# Altium project Stove_Light.PrjPcb
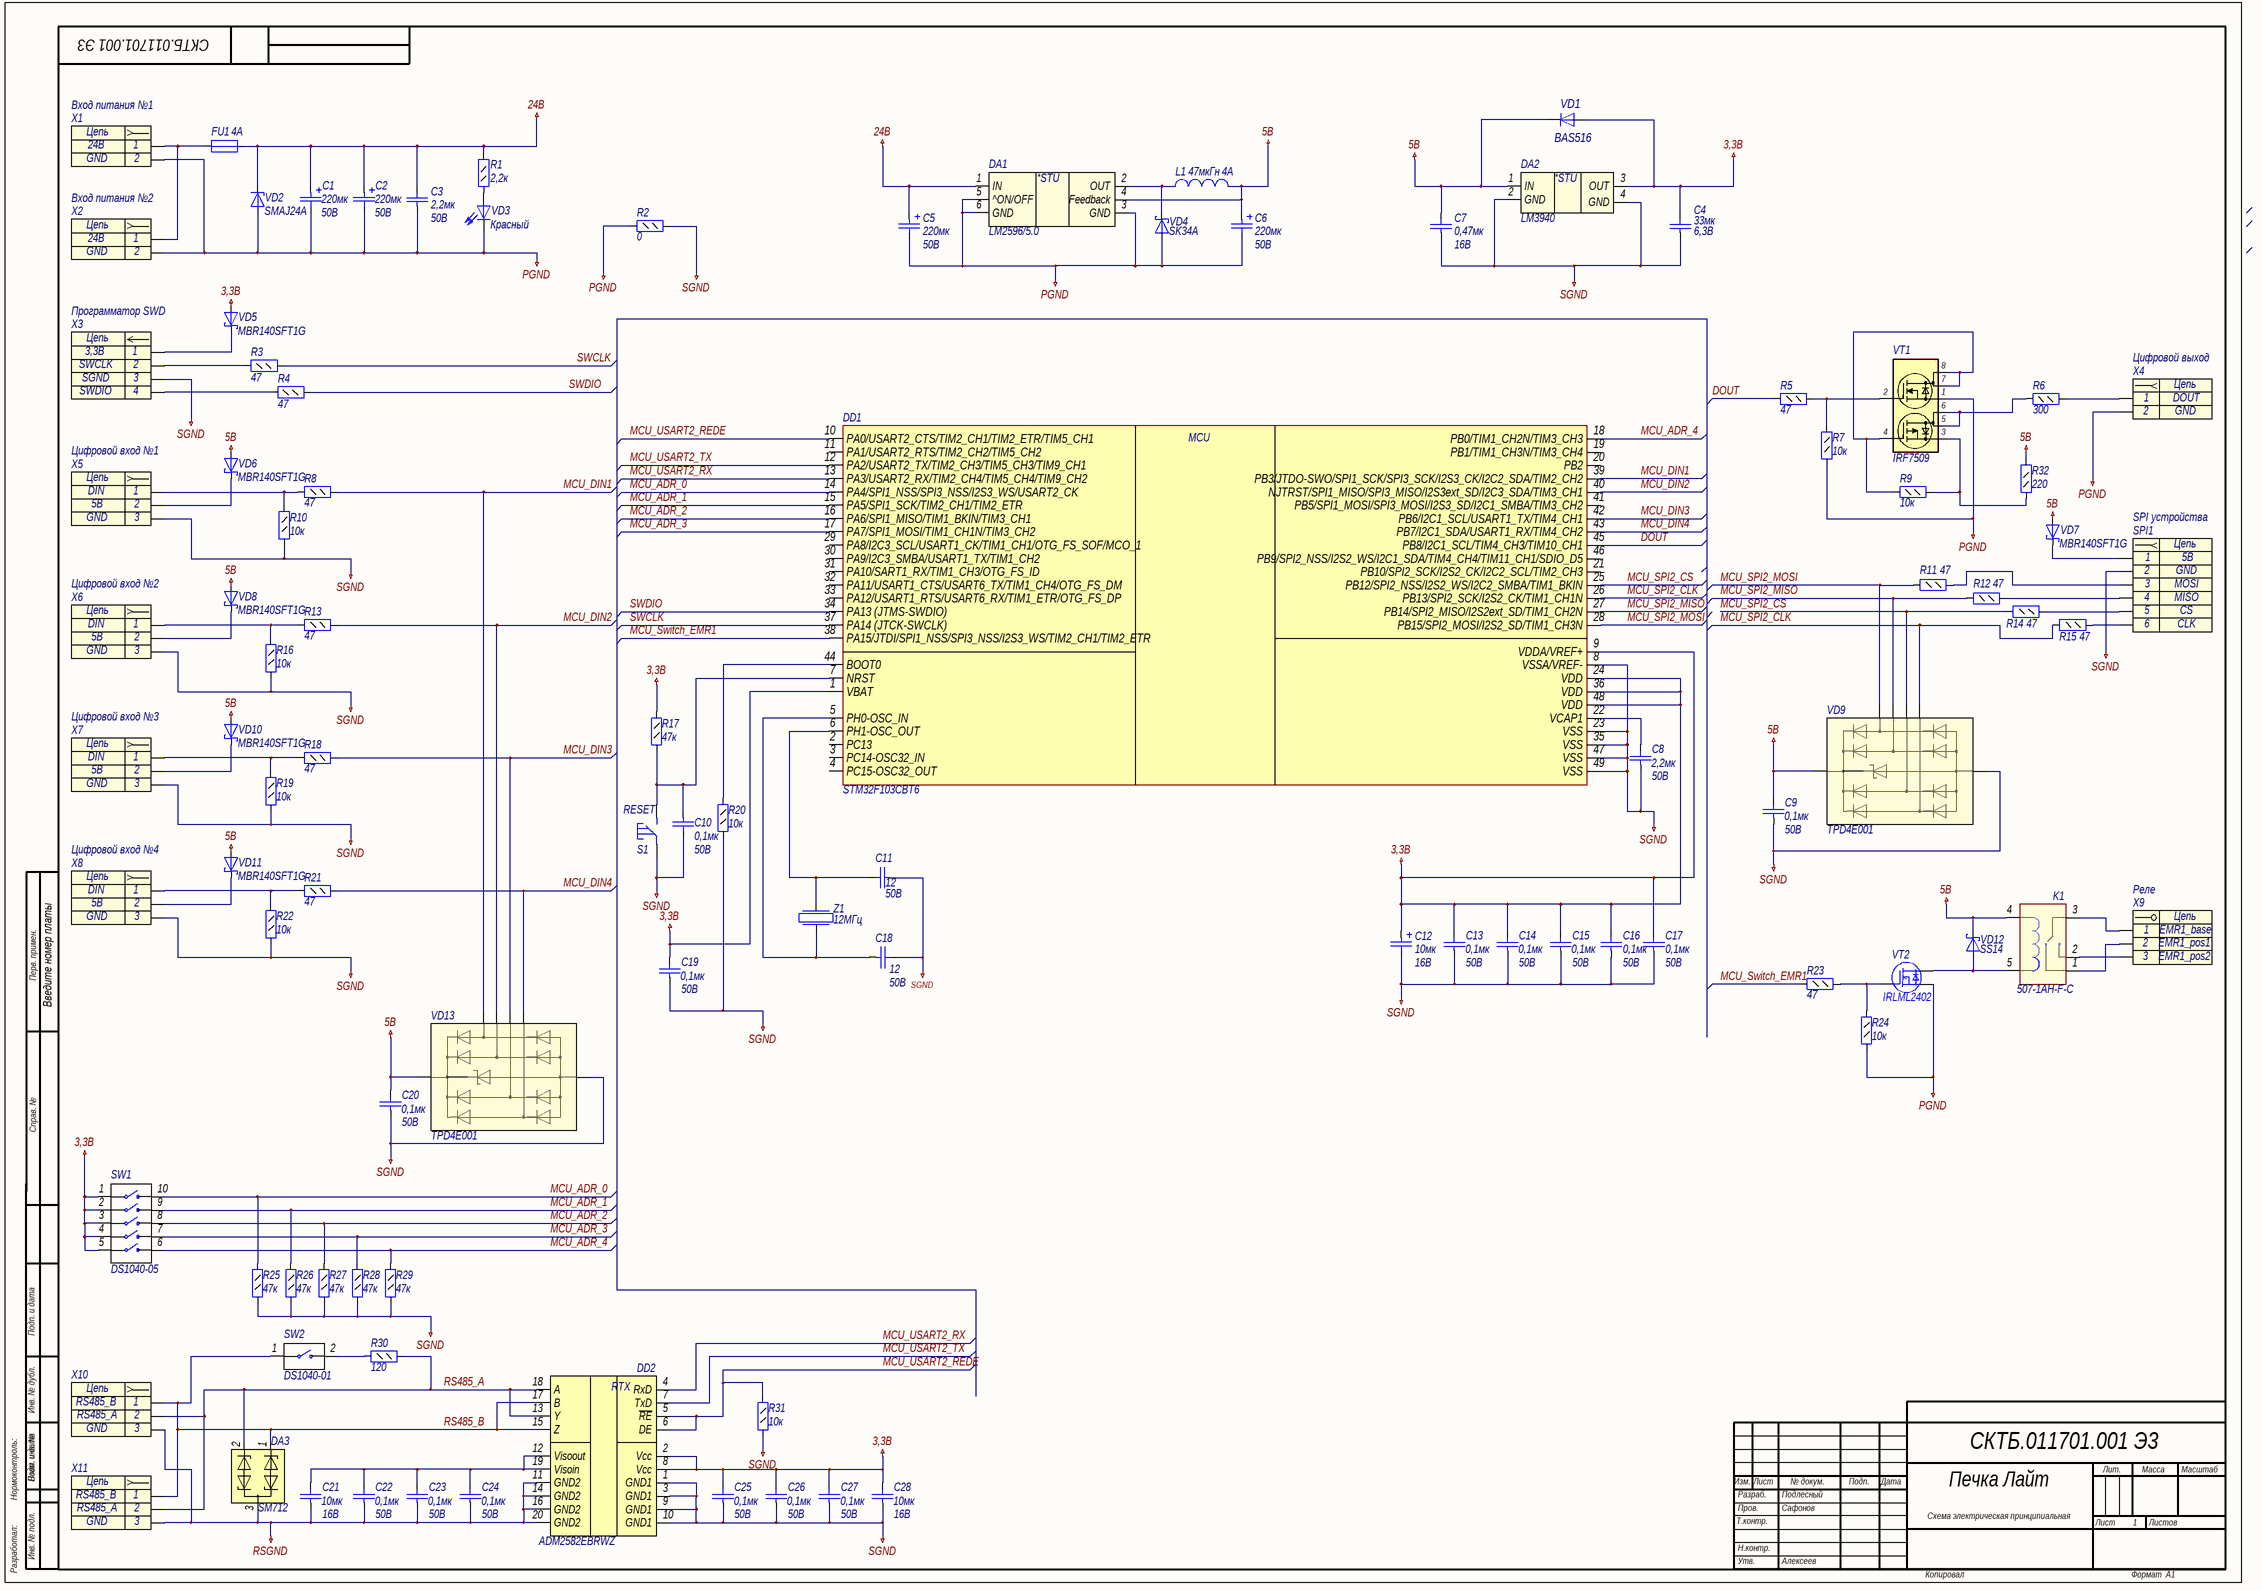
[diagram p0: Stove_Light.SchDoc]
1 sheet, 99 parts. Net scope: global (net labels, ports and power ports of the same name join across sheets).
Board file: Stove_Light.PcbDoc

## Sheet Stove_Light.SchDoc: Печка Лайт
size 840 x 594 mm; ApprovedBy: Алексеев; CheckedBy: Сафонов; Author: Подлесный; CompanyName: ЦНИИ РТК; DrawnBy: Подлесный; Engineer: Подлесный; Organization: ЦНИИ РТК; DocumentNumber: СКТБ.011701.001 Э3; Revision: Королев; SheetTotal: 1; DocumentType: Схема электрическая принципиальная; Format: A1; PageSetup: Record=PageOptions|CenterHorizontal=True|CenterVertical=True|PrintScale=0.33|XCorrection=1.00|YCorrection=1.00|PrintKind=1|BorderSize=5000000|LeftOffset=0|BottomOffset=0|Orientation=2|PaperLength=2970|PaperWidth=2100|Scale=100|PaperSource=7|PrintQuality=600|MediaType=1|DitherType=10|PrintScaleMode=1|PaperKind=A4|PaperIndex=9; DocumentName: Печка Лайт; ImagePath: Введите номер платы

### Parts
C1  220мк  Voltage: 50В  [Cap_SMD_radial_polar(10x10.5)]
C2  220мк  Voltage: 50В  [Cap_SMD_radial_polar(10x10.5)]
C3  Voltage: 50В  [C1206]  (hidden comment: 2,2мк)
C4  value 33мк  Voltage: 6,3В  [C1210]  (hidden comment: 1мк)
C5  Voltage: 50В  [Cap_SMD_radial_polar(10x10.5)]  (hidden comment: 220мк)
C6  Voltage: 50В  [Cap_SMD_radial_polar(10x10.5)]  (hidden comment: 220мк)
C7  Voltage: 16В  [C0603]  (hidden comment: 0,47мк)
C8  2,2мк  Voltage: 50В  [C1206]
C9  0,1мк  Voltage: 50В  [C0603]
C10  0,1мк  Voltage: 50B  [C0603]
C11  12  Voltage: 50B  [C0603]
C12  10мк  Voltage: 16В  [C1206]
C13  0,1мк  Voltage: 50В  [C0603]
C14  0,1мк  Voltage: 50В  [C0603]
C15  0,1мк  Voltage: 50В  [C0603]
C16  0,1мк  Voltage: 50В  [C0603]
C17  0,1мк  Voltage: 50В  [C0603]
C18  Voltage: 50В  [C0603]  (hidden comment: 12)
C19  0,1мк  Voltage: 50В  [C0603]
C20  0,1мк  Voltage: 50В  [C0603]
C21  10мк  Voltage: 16В  [C0603]
C22  0,1мк  Voltage: 50В  [C0603]
C23  0,1мк  Voltage: 50В  [C0603]
C24  0,1мк  Voltage: 50В  [C0603]
C25  0,1мк  Voltage: 50В  [C0603]
C26  0,1мк  Voltage: 50В  [C0603]
C27  0,1мк  Voltage: 50В  [C0603]
C28  10мк  Voltage: 16В  [C0603]
DA1  LM2596/5.0  [TO-263]
DA2  LM3940  [SOT223]
DA3  SM712  [SOT23-3]
DD1  STM32F103CBT6  [LQFP48_N]
DD2  ADM2582EBRWZ  [SO20W]
FU1  value 4A  [F5.1]  (hidden comment: RXEF300)
K1  507-1AH-F-C  [EMR 845(H)-1C]
L1  Imax: 4А  [SDR0604]  (hidden comment: 47мкГн)
R1  2,2к  [R0603]
R2  0  [R0603]
R3  47  [R0603]
R4  47  [R0603]
R5  47  [R0603]
R6  300  [R0603]
R7  10к  [R0603]
R8  47  [R0603]
R9  10к  [R0603]
R10  10к  [R0603]
R11  47  [R0603]
R12  47  [R0603]
R13  47  [R0603]
R14  47  [R0603]
R15  47  [R0603]
R16  10к  [R0603]
R17  47к  [R0603]
R18  47  [R0603]
R19  10к  [R0603]
R20  10к  [R0603]
R21  47  [R0603]
R22  10к  [R0603]
R23  47  [R0603]
R24  10к  [R0603]
R25  47к  [R0603]
R26  47к  [R0603]
R27  47к  [R0603]
R28  47к  [R0603]
R29  47к  [R0603]
R30  120  [R0603]
R31  10к  [R0603]
R32  220  [R0603]
S1  RESET  [Button_SMD]
SPI1  SPI устройства  [CWF-6]
SW1  DS1040-05  [DIP5_R]
SW2  DS1040-01  [DIP1_R]
VD1  BAS516  [SOD523]
VD2  SMAJ24A  [SMA]
VD3  Красный  [L_0805]
VD4  SK34A  [SMA]
VD5  MBR140SFT1G  [SMA]
VD6  MBR140SFT1G  [SMA]
VD7  MBR140SFT1G  [SMA]
VD8  MBR140SFT1G  [SMA]
VD9  TPD4E001  [SOT23-6]
VD10  MBR140SFT1G  [SMA]
VD11  MBR140SFT1G  [SMA]
VD12  SS14  [SMA]
VD13  TPD4E001  [SOT23-6]
VT1  IRF7509  [Micro8]
VT2  IRLML2402  [SOT23-3_H]
X1  Вход питания №1  [CWF-2]
X2  Вход питания №2  [CWF-2]
X3  Программатор SWD  [PLS-4]
X4  Цифровой выход  [CWF-2]
X5  Цифровой вход №1  [CWF-3]
X6  Цифровой вход №2  [CWF-3]
X7  Цифровой вход №3  [CWF-3]
X8  Цифровой вход №4  [CWF-3]
X9  Реле  [DT-128V-3]
X10  (no value)  [CWF-3]
X11  (no value)  [CWF-3]
Z1  12MГц  [QSMD3.2x2.5_A]

### Nets
3,3В: C4.2 C12.1 C13.2 C14.2 C15.2 C16.2 C17.2 C19.2 C25.2 C26.2 C27.2 C28.2 DA2.3(OUT) DD1.1(VBAT) DD1.9(VDDA/VREF+) DD1.24(VDD) DD1.36(VDD) DD1.48(VDD) DD2.2(Vcc) DD2.8(Vcc) R17.1 SW1.1 SW1.2 SW1.3 SW1.4 SW1.5 VD1.2(A) VD5.2(A)
5В: C6.1 C7.2 C9.2 C20.2 DA1.4(Feedback) DA2.1(IN) K1.4(sw1) L1.2 R32.2 VD1.1(K) VD6.2(A) VD7.2(A) VD8.2(A) VD9.5(VCC) VD10.2(A) VD11.2(A) VD12.1(K) VD13.5(VCC)
24В: C1.1 C2.1 C3.2 C5.1 DA1.1(IN) FU1.2 R1.2 VD2.1(K)
PGND: C1.2 C2.2 C3.1 C5.2 C6.2 DA1.3(GND) DA1.5(^ON/OFF) DA1.6(GND) R2.2 R7.2 R24.2 VD2.2(A) VD3.1(K) VD4.2(A) VT1.1(S1) VT2.2(S) X1.2 X2.2 X4.2
RSGND: C21.1 C22.1 C23.1 C24.1 DA3.3 DD2.11(GND2) DD2.14(GND2) DD2.16(GND2) DD2.20(GND2) X10.3 X11.3
SGND: C4.1 C7.1 C8.1 C9.1 C10.2 C11.1 C12.2 C13.1 C14.1 C15.1 C16.1 C17.1 C18.2 C19.1 C20.1 C25.1 C26.1 C27.1 C28.1 DA2.2(GND) DA2.4(GND) DD1.8(VSSA/VREF-) DD1.23(VSS) DD1.35(VSS) DD1.47(VSS) DD1.49(VSS) DD2.1(GND1) DD2.3(GND1) DD2.9(GND1) DD2.10(GND1) R2.1 R10.2 R16.2 R19.2 R20.2 R22.2 R25.2 R26.2 R27.2 R28.2 R29.2 R31.2 S1.1 SPI1.2 VD9.2(GND) VD13.2(GND) X3.3 X5.3 X6.3 X7.3 X8.3
DOUT: DD1.45(PB8/I2C1_SCL/TIM4_CH3/TIM10_CH1) R5.2
MCU_ADR_0: DD1.14(PA4/SPI1_NSS/SPI3_NSS/I2S3_WS/USART2_CK) R25.1 SW1.10
MCU_ADR_1: DD1.15(PA5/SPI1_SCK/TIM2_CH1/TIM2_ETR) R26.1 SW1.9
MCU_ADR_2: DD1.16(PA6/SPI1_MISO/TIM1_BKIN/TIM3_CH1) R27.1 SW1.8
MCU_ADR_3: DD1.17(PA7/SPI1_MOSI/TIM1_CH1N/TIM3_CH2) R28.1 SW1.7
MCU_ADR_4: DD1.18(PB0/TIM1_CH2N/TIM3_CH3) R29.1 SW1.6
MCU_DIN1: DD1.39(PB3/JTDO-SWO/SPI1_SCK/SPI3_SCK/I2S3_CK/I2C2_SDA/TIM2_CH2) R8.1 VD13.1(IO1)
MCU_DIN2: DD1.40(NJTRST/SPI1_MISO/SPI3_MISO/I2S3ext_SD/I2C3_SDA/TIM3_CH1) R13.1 VD13.3(IO2)
MCU_DIN3: DD1.42(PB6/I2C1_SCL/USART1_TX/TIM4_CH1) R18.1 VD13.4(IO3)
MCU_DIN4: DD1.43(PB7/I2C1_SDA/USART1_RX/TIM4_CH2) R21.1 VD13.6(IO4)
MCU_SPI2_CLK: DD1.26(PB13/SPI2_SCK/I2S2_CK/TIM1_CH1N) R15.2 VD9.6(IO4)
MCU_SPI2_CS: DD1.25(PB12/SPI2_NSS/I2S2_WS/I2C2_SMBA/TIM1_BKIN) R14.2 VD9.4(IO3)
MCU_SPI2_MISO: DD1.27(PB14/SPI2_MISO/I2S2ext_SD/TIM1_CH2N) R12.2 VD9.3(IO2)
MCU_SPI2_MOSI: DD1.28(PB15/SPI2_MOSI/I2S2_SD/TIM1_CH3N) R11.2 VD9.1(IO1)
MCU_Switch_EMR1: DD1.38(PA15/JTDI/SPI1_NSS/SPI3_NSS/I2S3_WS/TIM2_CH1/TIM2_ETR) R23.2
MCU_USART2_REDE: DD1.10(PA0/USART2_CTS/TIM2_CH1/TIM2_ETR/TIM5_CH1) DD2.5(~{RE}) DD2.6(DE) R31.1
MCU_USART2_RX: DD1.13(PA3/USART2_RX/TIM2_CH4/TIM5_CH4/TIM9_CH2) DD2.4(RxD)
MCU_USART2_TX: DD1.12(PA2/USART2_TX/TIM2_CH3/TIM5_CH3/TIM9_CH1) DD2.7(TxD)
RS485_A: DA3.2 DD2.13(Y) DD2.18(A) R30.1 X10.2 X11.2
RS485_B: DA3.1 DD2.15(Z) DD2.17(B) SW2.1 X10.1 X11.1
SWCLK: DD1.37(PA14_(JTCK-SWCLK)) R3.2
SWDIO: DD1.34(PA13_(JTMS-SWDIO)) R4.2
NetC8_2: C8.2 DD1.22(VCAP1)
NetC10_1: C10.1 DD1.7(NRST) R17.2 S1.3
NetC11_2: C11.2 DD1.6(PH1-OSC_OUT) Z1.1
NetC18_1: C18.1 DD1.5(PH0-OSC_IN) Z1.2
NetC21_2: C21.2 C22.2 C23.2 C24.2 DD2.12(Visoout) DD2.19(Visoin)
NetDA1_2: DA1.2(OUT) L1.1 VD4.1(K)
NetDD1_44: DD1.44(BOOT0) R20.1
NetFU1_1: FU1.1 X1.1 X2.1
NetK1_1: K1.1(pos1) X9.2
NetK1_2: K1.2(pos2) X9.3
NetK1_3: K1.3(base) X9.1
NetK1_5: K1.5(sw2) VD12.2(A) VT2.3(D)
NetR1_1: R1.1 VD3.2(A)
NetR3_1: R3.1 X3.2
NetR4_1: R4.1 X3.4
NetR5_1: R5.1 R7.1 VT1.2(G1)
NetR6_1: R6.1 VT1.5(D2) VT1.6(D2)
NetR6_2: R6.2 X4.1
NetR8_2: R8.2 R10.1 X5.1
NetR9_1: R9.1 VT1.4(G2) VT1.7(D1) VT1.8(D1)
NetR9_2: R9.2 R32.1 VT1.3(S2)
NetR11_1: R11.1 SPI1.3
NetR12_1: R12.1 SPI1.4
NetR13_2: R13.2 R16.1 X6.1
NetR14_1: R14.1 SPI1.5
NetR15_1: R15.1 SPI1.6
NetR18_2: R18.2 R19.1 X7.1
NetR21_2: R21.2 R22.1 X8.1
NetR23_1: R23.1 R24.1 VT2.1(G)
NetR30_2: R30.2 SW2.2
NetSPI1_1: SPI1.1 VD7.1(K)
NetVD5_1: VD5.1(K) X3.1
NetVD6_1: VD6.1(K) X5.2
NetVD8_1: VD8.1(K) X6.2
NetVD10_1: VD10.1(K) X7.2
NetVD11_1: VD11.1(K) X8.2

Not connected (* = marked no-connect by the designer): DD1 2(PC13) 3(PC14-OSC32_IN) 4(PC15-OSC32_OUT) 11(PA1/USART2_RTS/TIM2_CH2/TIM5_CH2) 19(PB1/TIM1_CH3N/TIM3_CH4) 20(PB2) 21(PB10/SPI2_SCK/I2S2_CK/I2C2_SCL/TIM2_CH3) 29(PA8/I2C3_SCL/USART1_CK/TIM1_CH1/OTG_FS_SOF/MCO_1) 30(PA9/I2C3_SMBA/USART1_TX/TIM1_CH2) 31(PA10/SART1_RX/TIM1_CH3/OTG_FS_ID) 32(PA11/USART1_CTS/USART6_TX/TIM1_CH4/OTG_FS_DM) 33(PA12/USART1_RTS/USART6_RX/TIM1_ETR/OTG_FS_DP) 41(PB5/SPI1_MOSI/SPI3_MOSI/I2S3_SD/I2C1_SMBA/TIM3_CH2) 46(PB9/SPI2_NSS/I2S2_WS/I2C1_SDA/TIM4_CH4/TIM11_CH1/SDIO_D5)

### Notes on the sheet
- Перв. примен.
- Справ. №
- Подп. и дата
- Инв. № дубл.
- Взам. инв. №
- Нормоконтроль:
- Изм.
- Лист
- № докум.
- Подп.
- Дата
- Лит.
- Масса
- Масштаб
- Т.контр.
- Пров.
- Разраб.
- Листов
- Разработал:
- Инв. № подл.
- Н.контр.
- Утв.
- Копировал
- Формат
- (in symbol ADM2587EBRWZ) RTX
- (in symbol Header_2_sct) Цепь
- (in symbol Header_3_sct) Цепь
- (in symbol Header_3_trm) Цепь
- (in symbol Header_4_plg) Цепь
- (in symbol Header_6_sct) Цепь
- (in symbol LM2596) *STU
- (in symbol LM3940) *STU
- (in symbol STM32F104Cx) MСU

### Library data of the parts
C1 C2 = Capacitor_pol: Конденсатор поляризованный; Name: ECAP SMD; Value: 220мк
C3 C7 C18 = Capacitor: Конденсатор
  C3: Value: 2,2мк
  C7: Value: 0,47мк
  C18: Value: 12
C4 = Capacitor: Конденсатор; Name: GRM32DR60J336ME19L
C5 C6 = Capacitor_pol: Конденсатор полярный; Name: LOW ESR; Value: 220мк
C8 = Capacitor: Конденсатор; Name: GRM31CR71H225KA88L; Value: 2,2мк
C9 C10 C13-C17 C19 C20 C22-C27 = Capacitor: Конденсатор; Name: GRM21BR71H104K; Value: 0,1мк
C11 = Capacitor: Конденсатор; Name: GRM2165C1H160J; Value: 12
C12 = Capacitor_pol: Конденсатор танталовый; Value: 10мк
C21 C28 = Capacitor: Конденсатор; Name: GRM21BR61C106K; Value: 10мк
DA1 = LM2596: 3-A Step-Down Voltage Regulator; Imax: 5A; Input Voltage Range: 40В
DA2 = LM3940: Low-Dropout Regulator for 5-V to 3.3-V Conversion
DA3 = SM712: SM712.TCT, Диод защитный для устройсв стандарта RS-485, 400Вт, 12В, [SOT-23]; Power: 400Вт; Voltage: 12В; Name: SM712
DD1 = STM32F104Cx: Name: STM32F103CBT6
DD2 = ADM2587EBRWZ: Приемопередатчик RS485 изолированный; Link: *; Name: ADM2582EBRWZ
FU1 = Fuse: RXEF300 (RXE300), 3 А, Предохранитель самовосстанавливающийся, PolySwitch; Name: RXEF300
K1 = 845(H)-1C: Электромагнитное реле; Vnom: 5В; Imax: 12А; Vmax: 240В; Name: 507-1AH-F-C
L1 = Inductor: Катушка индуктивности; Name: SDR0604-470KL; R: 0.37; Value: 47мкГн
R1-R4 = Resistor_0,125Вт: Резистор
  R1: Value: 2,2к
  R2: Value: 0
  R3 R4: Value: 47
R5-R8 R11-R15 R18 R21 R23 R32 = Resistor_0,125Вт: 0.125Вт 0805 47 Ом, 1%, Чип резистор (SMD)
  R5 R8 R11-R15 R18 R21 R23: Value: 47
  R6: Value: 300
  R7: Value: 10к
  R32: Value: 220
R9 R10 R16 R17 R19 R20 R22 R24-R31 = Resistor_0,125Вт: 0.125Вт 0805 10 кОм, 1%, Чип резистор (SMD)
  R9 R10 R16 R19 R20 R22 R24 R31: Value: 10к
  R17 R25-R29: Value: 47к
  R30: Value: 120
S1 = Button_SMD: Кнопка; Name: RESET
SPI1 = Header_6_sct: Разъем - 5 конт. розетка; Contact_1: 5В; Contact_2: GND; Contact_3: MOSI; Contact_4: MISO; Contact_5: CS; Contact_6: CLK; Name: SPI устройства
SW1 = DS1040-05: DIP переключатель
SW2 = DS1040-01: DIP переключатель
VD1 = Diode: Диод; Name: BAS516
VD2 = DiodeZener: Стабилитрон; Name: SMAJ24A
VD3 = LED_L: Светодиод_красный; Vf: 2,1В; Imax: 20m; Name: BL-LS0805UHR
VD4-VD8 VD10-VD12 = DiodeSchottky: Диод Шоттки
  VD4: Name: SK34A
  VD5-VD8 VD10 VD11: Name: MBR140SFT1G
  VD12: Name: SS14
VD9 VD13 = TPD4E001: Диодная сборка; Manufacturer: Texas Instruments; Name: TPD4E001
VT1 = IRF7509: Комплементарная сборка МОП; Name: IRF7509
VT2 = IRLML2402: MOSFET; Manufacturer: International Rectifier; Manufacturer Part Number: IRLML2402GTRPBF; FET Type: MOSFET N-Channel, Metal Oxide; FET Feature: Logic Level Gate; Drain to Source Voltage (Vdss): 20V; Current - Continuous Drain (Id) @ 25°C: 1.2A (Ta); Rds On (Max) @ Id, Vgs: 250 mOhm @ 930mA, 4.5V; Vgs(th) (Max) @ Id: 700mV @ 250µA; Gate Charge (Qg) @ Vgs: 3.9nC @ 4.5V; Input Capacitance (Ciss) @ Vds: 110pF @ 15V; Power - Max: 540mW; Supplier 1: Digi-Key; Supplier Part Number 1: IRLML2402GTRPBFTR-ND; Category: Discrete Semiconductor Products; Packaging: Tape & Reel (TR); Supplier: Digi-Key; RoHS: RoHS Compliant; Mounting Type: Surface Mount; Package / Case: TO-236-3, SC-59, SOT-23-3; Supplier Device Package: Micro3™/SOT-23; Supplier Part Number: IRLML2402GTRPBFTR-ND; Name: IRLML2402
X1 X2 = Header_2_sct: Разъем - 2 конт. розетка; Contact_1: 24В; Contact_2: GND
  X1: Name: Вход питания №1
  X2: Name: Вход питания №2
X3 = Header_4_plg: Разъем - 4 конт. вилка; Contact_1: 3,3В; Contact_2: SWCLK; Contact_3: SGND; Contact_4: SWDIO; Name: Программатор SWD
X4 = Header_2_sct: Разъем - 2 конт. розетка; Contact_1: DOUT; Contact_2: GND; Name: Цифровой выход
X5-X8 = Header_3_sct: Разъем - 2 конт. розетка; Contact_1: DIN; Contact_2: 5В; Contact_3: GND
  X5: Name: Цифровой вход №1
  X6: Name: Цифровой вход №2
  X7: Name: Цифровой вход №3
  X8: Name: Цифровой вход №4
X9 = Header_3_trm: Разъем - 3 конт. клемма; Contact_1: EMR1_base; Contact_3: EMR1_pos2; Contact_2: EMR1_pos1; Name: Реле
X10 X11 = Header_3_sct: Разъем - 2 конт. розетка; Contact_1: RS485_B; Contact_2: RS485_A; Contact_3: GND
Z1 = Crystal: Кварцевый резонатор; Value: 12MГц